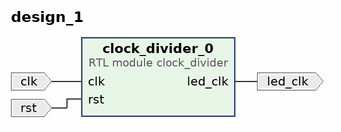
[diagram p0: block diagram of the top level]
# Vivado block design design_1, xc7z007sclg400-1, Vivado 2024.1.1
create_bd_design design_1

create_bd_port -dir I clk
create_bd_port -dir I rst
create_bd_port -dir O led_clk

create_bd_cell -type module -reference clock_divider clock_divider_0

# ---- connections ----

connect_bd_net [get_bd_ports clk] [get_bd_pins clock_divider_0/clk]
connect_bd_net [get_bd_pins clock_divider_0/led_clk] [get_bd_ports led_clk]
connect_bd_net [get_bd_ports rst] [get_bd_pins clock_divider_0/rst]

validate_bd_design
save_bd_design
